# EAGLE schematic frets-input2 (EAGLE 6.6.0)
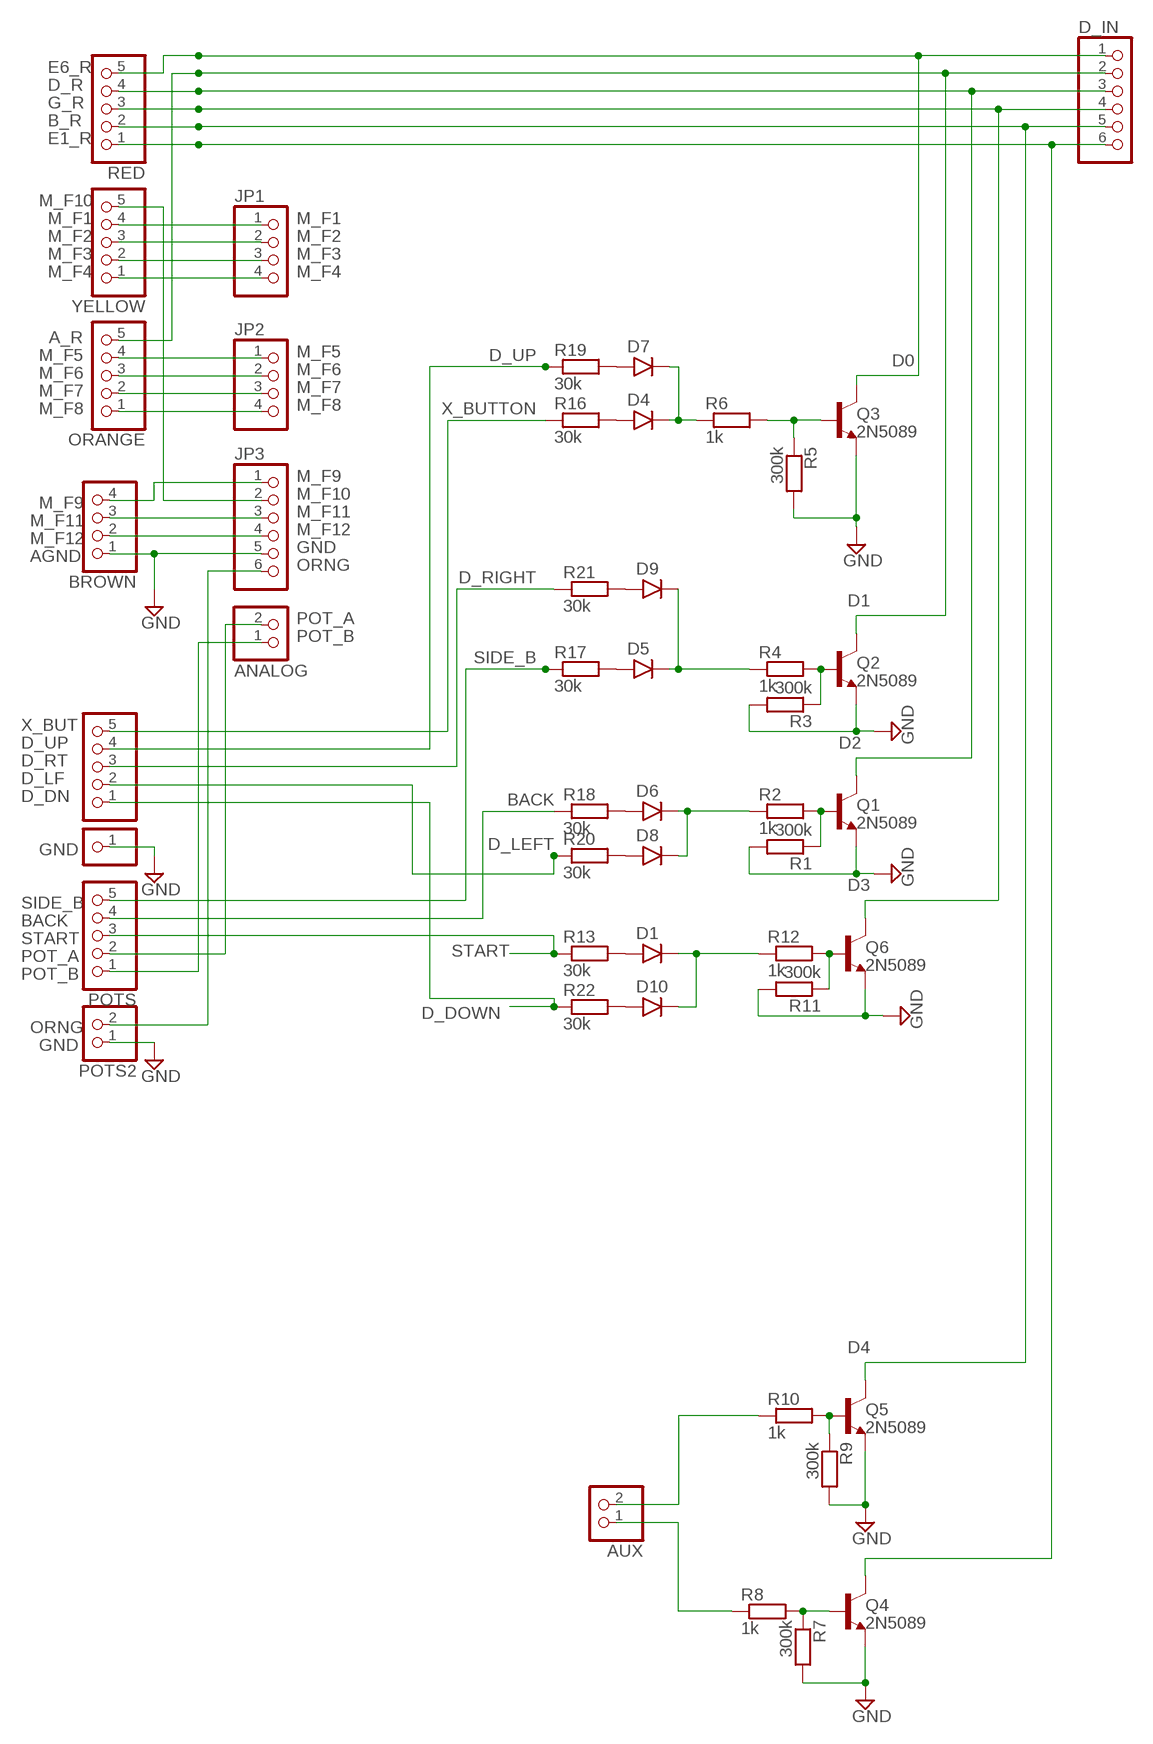
[diagram p0: schematic, sheet 1]

## Parts
ANALOG  PINHD-1X2  [1X02]
AUX  PINHD-1X2  [1X02]
BROWN  PINHD-1X4  [1X04]
D1  1N4148-4  [DO35-4]
D4  1N4148-2  [DO35-2]
D5  1N4148-4  [DO35-4]
D6  1N4148-2  [DO35-2]
D7  1N4148-2  [DO35-2]
D8  1N4148-2  [DO35-2]
D9  1N4148-4  [DO35-4]
D10  1N4148-2  [DO35-2]
D_IN  PINHD-1X6  [1X06]
DPAD  PINHD-1X5  [1X05]
DPAD2  PINHD-1X1  [1X01]
JP1  PINHD-1X4  [1X04]
JP2  PINHD-1X4  [1X04]
JP3  PINHD-1X6  [1X06]
ORANGE  PINHD-1X5  [1X05]
POTS  PINHD-1X5  [1X05]
POTS2  PINHD-1X2  [1X02]
Q1  2N5089  [TO92-]
Q2  2N5089  [TO92-]
Q3  2N5089  [TO92-]
Q4  2N5089  [TO92-]
Q5  2N5089  [TO92-]
Q6  2N5089  [TO92-]
R1  300k  6MM-EU1  [R0207/1V]
R2  1k  6MM-EU  [R0207/3]
R3  300k  6MM-EU1  [R0207/1V]
R4  1k  6MM-EU  [R0207/3]
R5  300k  6MM-EU1  [R0207/1V]
R6  1k  6MM-EU  [R0207/3]
R7  300k  6MM-EU1  [R0207/1V]
R8  1k  6MM-EU  [R0207/3]
R9  300k  6MM-EU1  [R0207/1V]
R10  1k  6MM-EU  [R0207/3]
R11  300k  6MM-EU1  [R0207/1V]
R12  1k  6MM-EU  [R0207/3]
R13  30k  6MM-EU  [R0207/3]
R16  30k  6MM-EU  [R0207/3]
R17  30k  6MM-EU  [R0207/3]
R18  30k  6MM-EU  [R0207/3]
R19  30k  6MM-EU  [R0207/3]
R20  30k  6MM-EU  [R0207/3]
R21  30k  6MM-EU  [R0207/3]
R22  30k  6MM-EU  [R0207/3]
RED  PINHD-1X5  [1X05]
YELLOW  PINHD-1X5  [1X05]

## Nets
BACK: POTS.4 R18.1
D0: D_IN.1 Q3.1(C) RED.5
D1: D_IN.2 ORANGE.5 Q2.1(C)
D2: D_IN.3 Q1.1(C) RED.4
D3: D_IN.4 Q6.1(C) RED.3
D4: D_IN.5 Q5.1(C) RED.2
D5: D_IN.6 Q4.1(C) RED.1
D_DOWN: DPAD.1 R22.1
D_LEFT: DPAD.2 R20.1
D_RIGHT: DPAD.3 R21.1
D_UP: DPAD.4 R19.1
GND: BROWN.1 DPAD2.1 JP3.5 POTS2.1 Q1.3(E) Q2.3(E) Q3.3(E) Q4.3(E) Q5.3(E) Q6.3(E) R1.2 R3.2 R5.2 R7.2 R9.2 R11.2
M_F1: JP1.1 YELLOW.4
M_F2: JP1.2 YELLOW.3
M_F3: JP1.3 YELLOW.2
M_F4: JP1.4 YELLOW.1
M_F5: JP2.1 ORANGE.4
M_F6: JP2.2 ORANGE.3
M_F7: JP2.3 ORANGE.2
M_F8: JP2.4 ORANGE.1
M_F9: BROWN.4 JP3.1
M_F10: JP3.2 YELLOW.5
M_F11: BROWN.3 JP3.3
M_F12: BROWN.2 JP3.4
N$2: Q2.2(B) R3.1 R4.2
N$3: AUX.2 R10.1
N$4: D5.C D9.C R4.1
N$5: Q3.2(B) R5.1 R6.2
N$6: Q1.2(B) R1.1 R2.2
N$7: D6.C D8.C R2.1
N$8: D4.A R16.2
N$9: D5.A R17.2
N$10: D4.C D7.C R6.1
N$11: Q4.2(B) R7.1 R8.2
N$12: D6.A R18.2
N$13: AUX.1 R8.1
N$14: Q5.2(B) R9.1 R10.2
N$15: D1.A R13.2
N$18: Q6.2(B) R11.1 R12.2
N$20: D1.C D10.C R12.1
N$21: D7.A R19.2
N$22: D8.A R20.2
N$23: D9.A R21.2
N$24: D10.A R22.2
ORNG: JP3.6 POTS2.2
POT_A: ANALOG.2 POTS.2
POT_B: ANALOG.1 POTS.1
SIDE_B: POTS.5 R17.1
START: POTS.3 R13.1
X_BUTTON: DPAD.5 R16.1

## Notes on the sheet
- E6_R
- D_R
- G_R
- B_R
- E1_R
- M_F10
- M_F1
- M_F2
- M_F3
- M_F4
- A_R
- M_F5
- M_F6
- M_F7
- M_F8
- M_F9
- M_F11
- M_F12
- AGND
- X_BUT
- D_UP
- D_RT
- D_LF
- D_DN
- GND
- SIDE_B
- BACK
- START
- POT_A
- POT_B
- ORNG
- GND

## Library data of the parts
ANALOG AUX POTS2 = pinhead:PINHD-1X2: PIN HEADER
BROWN JP1 JP2 = pinhead:PINHD-1X4: PIN HEADER
D1 D4-D10 = gm-diodes:1N4148: Fast Switching Diode DO-35 glass case a.k.a. 1N914
D_IN JP3 = pinhead:PINHD-1X6: PIN HEADER
DPAD ORANGE POTS RED YELLOW = pinhead:PINHD-1X5: PIN HEADER
DPAD2 = pinhead:PINHD-1X1: PIN HEADER
Q1-Q6 = gm-trans:2N5089: NPN TRANSISTOR EBC pinout also works for 2N3565
R1-R13 R16-R22 = gm-resistors:6MM-EU: 6mm Resistors (European schematic symbol) Leads spaced 1-6 holes apart for 0.1" perfboard. Suitable for 1/4 watt resistors.